# Altium schematic sheet [5]-OPI_MAIN.SchDoc
size A4
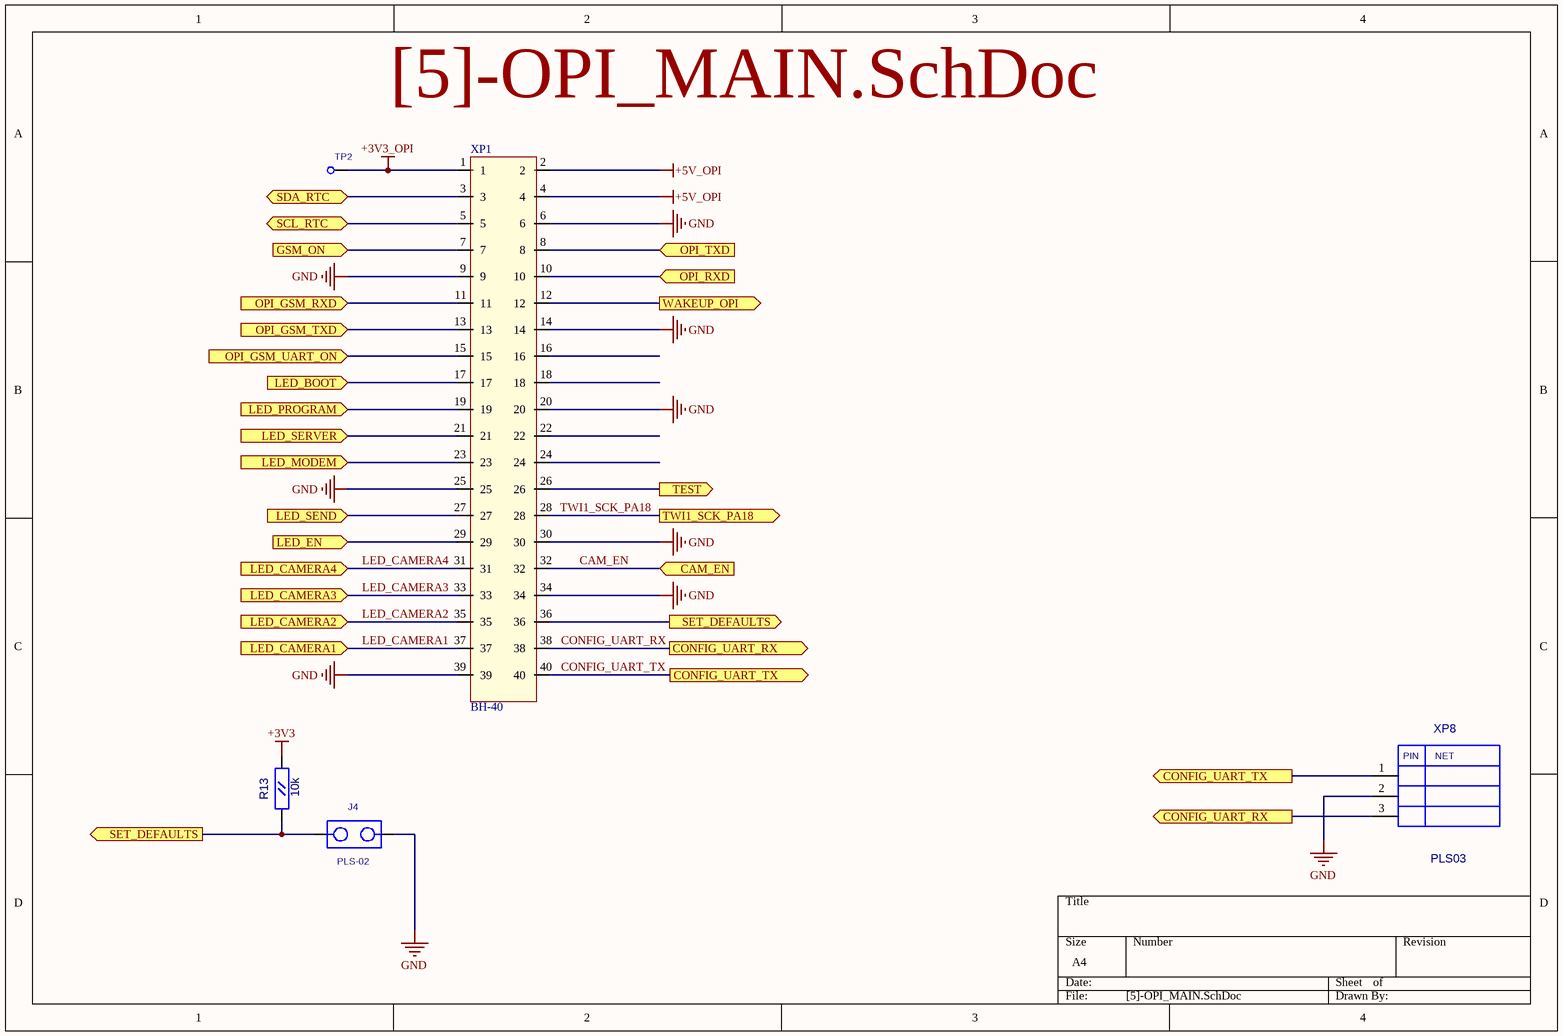
[diagram p0: [5]-OPI_MAIN.SchDoc]

## Parts
J4  PLS-02  [PLS-02]
R13  10k  [RC0603]
TP2  TESTPOINT1  [TESTPOINT1]  (value not drawn)
XP1  BH-40  [BH-40]
XP8  PLS03  [PLS-03]

## Ports
CAM_EN (in), CONFIG_UART_RX (out), CONFIG_UART_TX (out), GSM_ON (in), LED_BOOT (in), LED_CAMERA1 (in), LED_CAMERA2 (in), LED_CAMERA3 (in), LED_CAMERA4 (in), LED_EN (in), LED_MODEM (in), LED_PROGRAM (in), LED_SEND (in), LED_SERVER (in), OPI_GSM_RXD (in), OPI_GSM_TXD (in), OPI_GSM_UART_ON (in), OPI_RXD (in), OPI_TXD (in), SCL_RTC (bidir), SDA_RTC (bidir), SET_DEFAULTS (out), TEST (out), TWI1_SCK_PA18 (out), WAKEUP_OPI (out)

## Nets
+3V3: R13.2(B)
+3V3_OPI: TP2.1 XP1.1
+5V_OPI: XP1.2 XP1.4
GND: J4.2 XP1.6 XP1.9 XP1.14 XP1.20 XP1.25 XP1.30 XP1.34 XP1.39 XP8.2
CAM_EN: XP1.32 ; port CAM_EN
CONFIG_UART_RX: XP1.38 XP8.3 ; port CONFIG_UART_RX
CONFIG_UART_TX: XP1.40 XP8.1 ; port CONFIG_UART_TX
GSM_ON: XP1.7 ; port GSM_ON
LED_BOOT: XP1.17 ; port LED_BOOT
LED_CAMERA1: XP1.37 ; port LED_CAMERA1
LED_CAMERA2: XP1.35 ; port LED_CAMERA2
LED_CAMERA3: XP1.33 ; port LED_CAMERA3
LED_CAMERA4: XP1.31 ; port LED_CAMERA4
LED_EN: XP1.29 ; port LED_EN
LED_MODEM: XP1.23 ; port LED_MODEM
LED_PROGRAM: XP1.19 ; port LED_PROGRAM
LED_SEND: XP1.27 ; port LED_SEND
LED_SERVER: XP1.21 ; port LED_SERVER
OPI_GSM_RXD: XP1.11 ; port OPI_GSM_RXD
OPI_GSM_TXD: XP1.13 ; port OPI_GSM_TXD
OPI_GSM_UART_ON: XP1.15 ; port OPI_GSM_UART_ON
OPI_RXD: XP1.10 ; port OPI_RXD
OPI_TXD: XP1.8 ; port OPI_TXD
SCL_RTC: XP1.5 ; port SCL_RTC
SDA_RTC: XP1.3 ; port SDA_RTC
SET_DEFAULTS: J4.1 R13.1(A) XP1.36 ; port SET_DEFAULTS
TEST: XP1.26 ; port TEST
TWI1_SCK_PA18: XP1.28 ; port TWI1_SCK_PA18
WAKEUP_OPI: XP1.12 ; port WAKEUP_OPI

Not connected (* = marked no-connect by the designer): XP1 16 18 22 24

## Notes on the sheet
- (in symbol PLS03) PIN; NET

## Library data of the parts
R13 = RC0603: Value: 10k
XP1 = BH-40: 2.54mm connector with key; Value: BH-40
J4 = PLS-02: Value: *
TP2 = TESTPOINT1: Value: *
XP8 = PLS03: Value: *